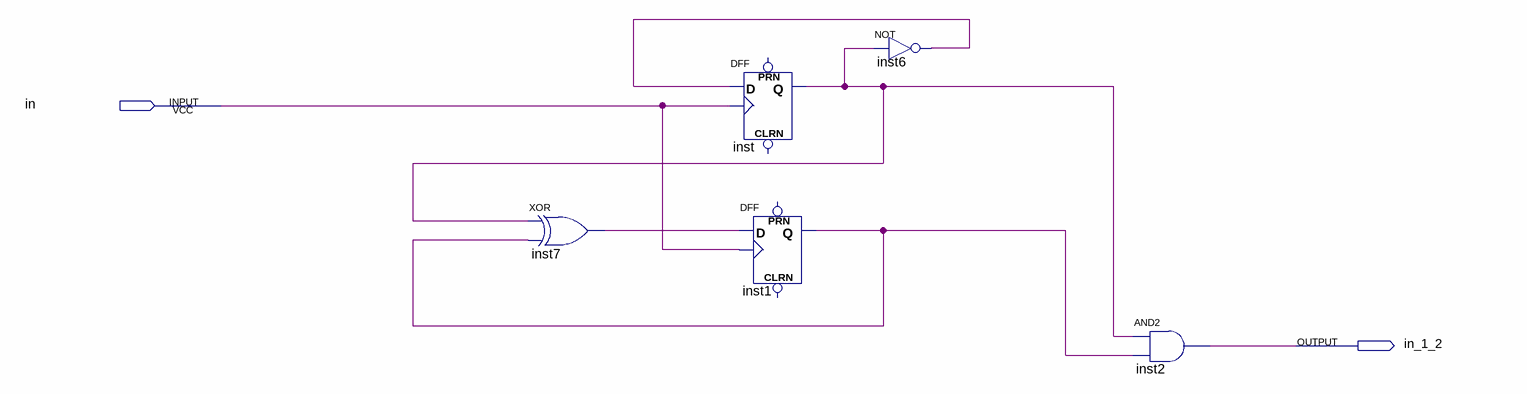
[diagram p0: schematic sheet]
// Quartus schematic in_1_2.bdf as structural Verilog: 5 symbols, 2 pins
module in_1_2 (
  input  in,
  output in_1_2
);

  wire inst1_q, inst6_out, inst7_out, inst_q;

  xor inst7 (inst7_out, inst_q, inst1_q);
  DFF inst (.CLK(in), .D(inst6_out), .Q(inst_q));  // open: CLRN, PRN
  DFF inst1 (.CLK(in), .D(inst7_out), .Q(inst1_q));  // open: CLRN, PRN
  not inst6 (inst6_out, inst_q);
  and inst2 (in_1_2, inst_q, inst1_q);
endmodule
